# Altium schematic sheet Menu-display schematic_2021-06-02.schdoc
size 298 x 175 mm
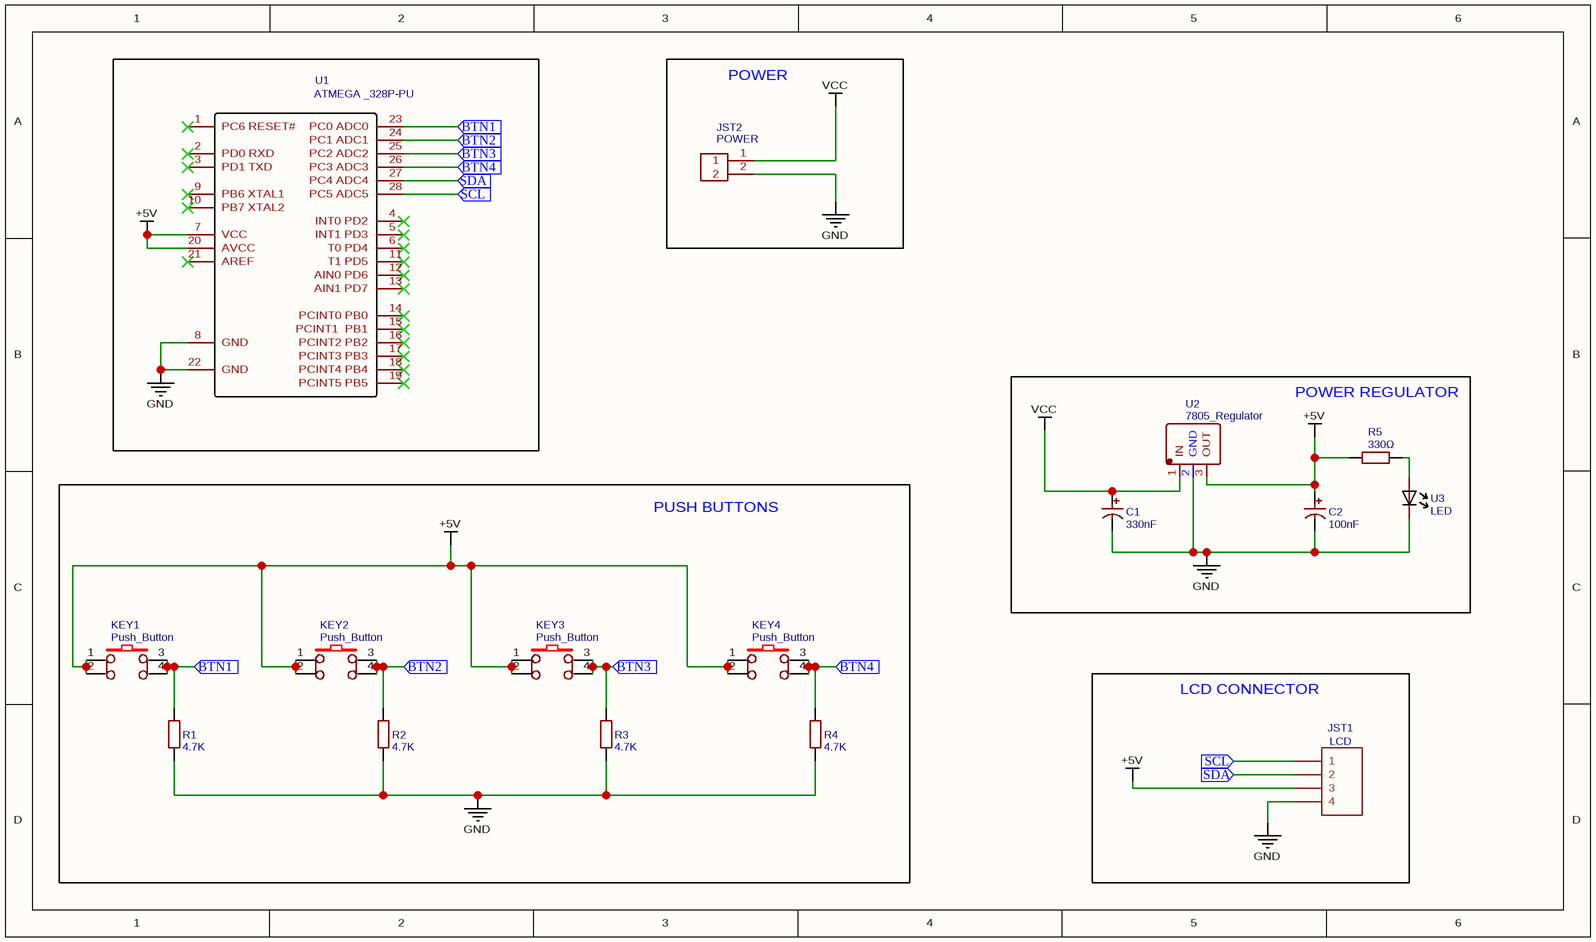
[diagram p0: Menu-display schematic_2021-06-02.schdoc]

## Parts
C1  330nF  [CAP-TH_BD5.0-P2.00-D0.8-FD]
C2  100nF  [CAP-TH_BD5.0-P2.00-D0.8-FD]
JST1  LCD  [JST_XH_4_PIN_TOP_ENTRY]
JST2  POWER  [CONN-TH_XHB-2A]
KEY1  Push_Button  [KEY-TH_4P-L6.0-W6.0-P4.50]
KEY2  Push_Button  [KEY-TH_4P-L6.0-W6.0-P4.50]
KEY3  Push_Button  [KEY-TH_4P-L6.0-W6.0-P4.50]
KEY4  Push_Button  [KEY-TH_4P-L6.0-W6.0-P4.50]
R1  4.7K  [AXIAL-0.4]
R2  4.7K  [AXIAL-0.4]
R3  4.7K  [AXIAL-0.4]
R4  4.7K  [AXIAL-0.4]
R5  330Ω  [AXIAL-0.4]
U1  ATMEGA _328P-PU  [DIP-28_L34.6-W7.3-P2.54-LS10.2-BL]
U2  7805_Regulator  [TO-220-3_L10.0-W4.5-P2.54-L]
U3  LED  [5MM LED]

## Blocks framed on the sheet
POWER: JST2
POWER REGULATOR: C1 C2 R5 U2 U3
PUSH BUTTONS: KEY1-KEY4 R1-R4
LCD CONNECTOR: JST1

## Ports
BTN1 (in), BTN2 (in), BTN3 (in), BTN4 (in), SCL (in), SDA (in)

## Nets
+5V: C2.1 JST1.3 KEY1.1 KEY1.2 KEY2.1 KEY2.2 KEY3.1 KEY3.2 KEY4.1 KEY4.2 R5.1 U1.7(VCC) U1.20(AVCC) U2.3(OUT)
GND: C1.2 C2.2 JST1.4 JST2.2 R1.1 R2.1 R3.1 R4.1 U1.8(GND) U1.22(GND) U2.2(GND) U3.2
VCC: C1.1 JST2.1 U2.1(IN)
BTN1: KEY1.3 KEY1.4 R1.2 U1.23(PC0_ADC0) ; port BTN1
BTN2: KEY2.3 KEY2.4 R2.2 U1.24(PC1_ADC1) ; port BTN2
BTN3: KEY3.3 KEY3.4 R3.2 U1.25(PC2_ADC2) ; port BTN3
BTN4: KEY4.3 KEY4.4 R4.2 U1.26(PC3_ADC3) ; port BTN4
SCL: JST1.1 U1.28(PC5_ADC5) ; port SCL
SDA: JST1.2 U1.27(PC4_ADC4) ; port SDA
NetR5_2: R5.2 U3.1

Not connected (* = marked no-connect by the designer): U1 1(PC6_RESET#)* 2(PD0_RXD)* 3(PD1_TXD)* 4(INT0_PD2)* 5(INT1_PD3)* 6(T0_PD4)* 9(PB6_XTAL1)* 10(PB7_XTAL2)* 11(T1_PD5)* 12(AIN0_PD6)* 13(AIN1_PD7)* 14(PCINT0_PB0)* 15(PCINT1__PB1)* 16(PCINT2_PB2)* 17(PCINT3_PB3)* 18(PCINT4_PB4)* 19(PCINT5_PB5)* 21(AREF)*

## Library data of the parts
C1 = 330nF: BOM_Manufacturer: ValuePro; BOM_Manufacturer Part: 0.1UF 50V; nameAlias: Capacitance; BOM_Supplier: LCSC; BOM_Supplier Part: C28061; BOM_JLCPCB Part Class: Extended Part; spicePre: C; spiceSymbolName: 0.1uF
C2 = 100nF: BOM_Manufacturer: ValuePro; BOM_Manufacturer Part: 0.1UF 50V; nameAlias: Capacitance; BOM_Supplier: LCSC; BOM_Supplier Part: C28061; BOM_JLCPCB Part Class: Extended Part; spicePre: C; spiceSymbolName: 0.1uF
JST1 = LCD: Contributor: fabiano.riccardi; spicePre: J; spiceSymbolName: JST_4 PIN
JST2 = POWER: BOM_Manufacturer: BOOMELE; BOM_Manufacturer Part: XHB-2A Connector; BOM_Supplier: LCSC; image: //image.lceda.cn/szlcsc/C57981.jpg; BOM_Supplier Part: C57981; BOM_JLCPCB Part Class: Extended Part; spicePre: C; spiceSymbolName: JST_2 PIN
KEY1-KEY4 = Push_Button: BOM_Manufacturer: ReliaPro; BOM_Manufacturer Part: button6*6*8.5; BOM_Supplier Part: C59980; BOM_Supplier: LCSC; image: http://image.lceda.cn/szlcsc/C59980.jpg; spicePre: K; spiceSymbolName: Push_Button
R1-R4 = 4.7K: BOM_Manufacturer: UniOhm; BOM_Manufacturer Part: MFR0W4F2200A50; Power: 1/4W; Tolerance: ±1%; BOM_EasyEDA: E57439; Value: Value; BOM_Supplier Part: E57439; BOM_Supplier: EasyEDA; spicePre: R; spiceSymbolName: RESISTOR
R5 = 330Ω: BOM_Manufacturer: UniOhm; BOM_Manufacturer Part: MFR0W4F2200A50; Power: 1/4W; Tolerance: ±1%; BOM_EasyEDA: E57439; Value: Value; BOM_Supplier Part: E57439; BOM_Supplier: EasyEDA; spicePre: R; spiceSymbolName: RESISTOR
U1 = ATMEGA _328P-PU: BOM_Manufacturer: MICROCHIP; BOM_Manufacturer Part: ATMEGA328P-PU; sourceId: Oic6oiASL; Contributor: LCSC; timeStamp: 1451725987; BOM_Supplier: LCSC; image: //image.lceda.cn/szlcsc/C33901.jpg; BOM_Supplier Part: C33901; spicePre: U; spiceSymbolName: ATMEGA _328P-PU
U2 = 7805_Regulator: BOM_Manufacturer: Foshan Blue Rocket Elec; BOM_Manufacturer Part: 7805; Contributor: LCSC; BOM_Supplier: LCSC; BOM_Supplier Part: C305416; BOM_JLCPCB Part Class: Extended Part; spicePre: U; spiceSymbolName: 7805_Regulator
U3 = LED: Contributor: Axbri; BOM_Manufacturer Part: 5mm LED; spicePre: U; spiceSymbolName: LED